# Altium schematic sheet Opa365Mod.SchDoc
size A4
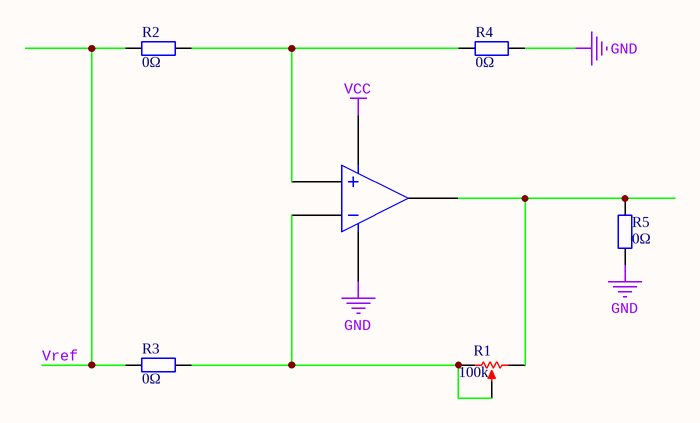
[diagram p0: Opa365Mod.SchDoc]

## Parts
R1  100k  [RP3362P]
R2  0Ω  [0805_R]
R3  0Ω  [0805_R]
R4  0Ω  [0805_R]
R5  0Ω  [0805_R]
U1  OPA365  [SO-8]  (value not drawn)

## Nets
GND: R4.2 R5.1 U1.4
VCC: U1.7
Vref: R2.1 R3.1
NetR1_1: R1.1(BOT) R5.2 U1.6
NetR1_2: R1.2(TAP) R1.3(TOP) R3.2 U1.2
NetR2_2: R2.2 R4.1 U1.3

## Library data of the parts
R1 = Rp: Potentiometer; Sim Note: Enter the Resistance value and the set point into parameter fields.; Set Position: 0.5; Published: 8-Jun-2000; LatestRevisionDate: 17-Jul-2002; LatestRevisionNote: Re-released for DXP Platform.; PackageReference: VR5; Publisher: Altium Limited; PackageDescription: Variable Resistor, Thru-Hole; 3 Leads
R2-R5 = 0805 0Ω (0R0) 1%: 贴片电阻; ComponentLink1Description: 供应商链接; ComponentLink1URL: http://www.szlcsc.com/product/details_18165.html; Package: 0805; Supplier: LC; SuppliersPartNumber: C17477